# Altium schematic sheet IO Peripherals.SchDoc
size A4; DocumentNumber: 6; Revision: C.1(PCB.SCH); SheetNumber: 4; SheetTotal: 4
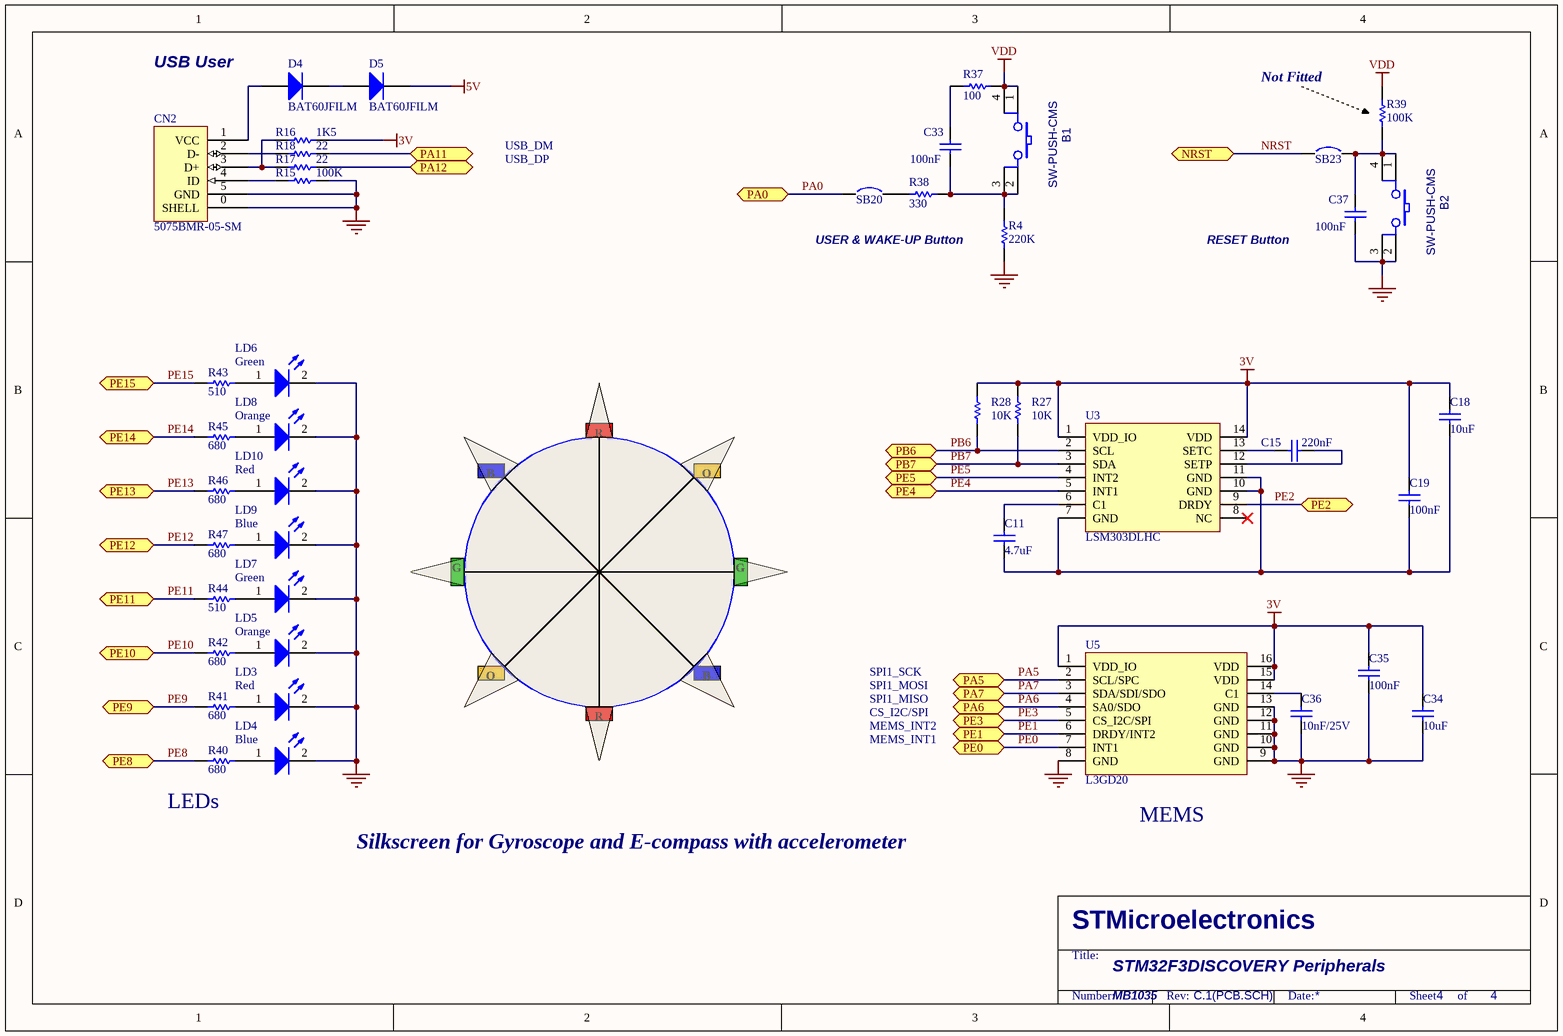
[diagram p0: IO Peripherals.SchDoc]

## Parts
B1  SW-PUSH-CMS  [BP1CMS]
B2  SW-PUSH-CMS  [BP1CMS]
C11  4.7uF  [0603C]
C15  220nF  [0603C]
C18  10uF  [0603C]
C19  100nF  [0603C]
C33  100nF  [0603C]
C34  10uF  [0603C]
C35  100nF  [0603C]
C36  10nF/25V  [0603C]
C37  100nF  [0603C]
CN2  5075BMR-05-SM  [USB-MINI-B-SMD]
D4  BAT60JFILM  [SOD323/A]
D5  BAT60JFILM  [SOD323/A]
LD3  Red  [0603D]
LD4  Blue  [0603D]
LD5  Orange  [0603D]
LD6  Green  [0603D]
LD7  Green  [0603D]
LD8  Orange  [0603D]
LD9  Blue  [0603D]
LD10  Red  [0603D]
R4  220K  [0603R]
R15  100K  [0402R]
R16  1K5  [0402R]
R17  22  [0402R]
R18  22  [0402R]
R27  10K  [0402R]
R28  10K  [0402R]
R37  100  [0402R]
R38  330  [0402R]
R39  100K  [0402R]
R40  680  [0603R]
R41  680  [0603R]
R42  680  [0603R]
R43  510  [0603R]
R44  510  [0603R]
R45  680  [0603R]
R46  680  [0603R]
R47  680  [0603R]
SB20  Circuit Breaker  [JP2_SMD]  (value not drawn)
SB23  Circuit Breaker  [JP2_SMD]  (value not drawn)
U3  LSM303DLHC  [LGA14]
U5  L3GD20  [LGA16]

## Ports
NRST, PA0, PA5, PA6, PA7, PA11, PA12, PB6, PB7, PE0, PE1, PE2, PE3, PE4, PE5, PE8, PE9, PE10, PE11, PE12, PE13, PE14, PE15

## Nets
3V: C18.2 C19.2 C34.2 C35.2 R16.2 R27.1 R28.1 U3.1(VDD_IO) U3.14(VDD) U5.1(VDD_IO) U5.15(VDD) U5.16(VDD)
5V: D5.2(K)
GND: B2.2 B2.3 C34.1 C35.1 C36.1 C37.1 CN2.0(SHELL) CN2.5(GND) LD3.2(K) LD4.2(K) LD5.2(K) LD6.2(K) LD7.2(K) LD8.2(K) LD9.2(K) LD10.2(K) R4.1 R15.2 U5.8(GND) U5.9(GND) U5.10(GND) U5.11(GND) U5.12(GND) U5.13(GND)
VDD: B1.1 B1.4 R37.2 R39.2
NRST: SB23.1 ; port NRST
PA0: SB20.1 ; port PA0
PA5: U5.2(SCL/SPC) ; port PA5
PA6: U5.4(SA0/SDO) ; port PA6
PA7: U5.3(SDA/SDI/SDO) ; port PA7
PA11: R18.2 ; port PA11
PA12: R17.2 ; port PA12
PB6: R28.2 U3.2(SCL) ; port PB6
PB7: R27.2 U3.3(SDA) ; port PB7
PE0: U5.7(INT1) ; port PE0
PE1: U5.6(DRDY/INT2) ; port PE1
PE2: U3.9(DRDY) ; port PE2
PE3: U5.5(CS_I2C/SPI) ; port PE3
PE4: U3.5(INT1) ; port PE4
PE5: U3.4(INT2) ; port PE5
PE8: R40.2 ; port PE8
PE9: R41.2 ; port PE9
PE10: R42.2 ; port PE10
PE11: R44.2 ; port PE11
PE12: R47.2 ; port PE12
PE13: R46.2 ; port PE13
PE14: R45.2 ; port PE14
PE15: R43.2 ; port PE15
NetB1_2: B1.2 B1.3 C33.1 R4.2 R38.2
NetB2_1: B2.1 B2.4 C37.2 R39.1 SB23.2
NetC11_1: C11.1 C18.1 C19.1 U3.7(GND) U3.10(GND) U3.11(GND)
NetC11_2: C11.2 U3.6(C1)
NetC15_1: C15.1 U3.13(SETC)
NetC15_2: C15.2 U3.12(SETP)
NetC33_2: C33.2 R37.1
NetC36_2: C36.2 U5.14(C1)
NetCN2_1: CN2.1(VCC) D4.1(A)
NetCN2_2: CN2.2(D-) R18.1
NetCN2_3: CN2.3(D+) R16.1 R17.1
NetCN2_4: CN2.4(ID) R15.1
NetD4_2: D4.2(K) D5.1(A)
NetLD3_1: LD3.1(A) R41.1
NetLD4_1: LD4.1(A) R40.1
NetLD5_1: LD5.1(A) R42.1
NetLD6_1: LD6.1(A) R43.1
NetLD7_1: LD7.1(A) R44.1
NetLD8_1: LD8.1(A) R45.1
NetLD9_1: LD9.1(A) R47.1
NetLD10_1: LD10.1(A) R46.1
NetR38_1: R38.1 SB20.2

Not connected (* = marked no-connect by the designer): U3 8(NC)*

## Notes on the sheet
- USB User
- Not Fitted
- USB_DM
- USB_DP
- USER & WAKE-UP Button
- RESET Button
- N
- R
- B
- O
- W
- G
- E
- SPI1_MOSI
- SPI1_SCK
- SPI1_MISO
- CS_I2C/SPI
- S
- MEMS_INT1
- MEMS_INT2
- (near R40) LEDs
- Silkscreen for Gyroscope and E-compass with accelerometer
- (near U5) MEMS
- STM32F3DISCOVERY Peripherals
- MB1035
- STMicroelectronics
- Title:
- Number:
- Rev:
- Date:
- Sheet       of

## Library data of the parts
B1 B2 = SW-PUSH-CMS: Non-Open Push-Button 0.1A 24V; Manuf_1: FARNELL; Manuf_Part_1: 535-930; Ref St: 9180120; cap_dec: ---
C11 C15 C18 C34 C36 = CAP: Capacitor; Value: 100nF; Published: 8-Jun-2000; Revision: July-2002: Re-released for DXP Platform.; Publisher: Altium Limited
C19 C33 C35 C37 = CAP: Capacitor; Published: 8-Jun-2000; Revision: July-2002: Re-released for DXP Platform.; Publisher: Altium Limited; Value: 100nF
CN2 = USB-MINI-typeB connector
D4 D5 = BAT60JFILM: Manuf_1: STM; Code - JEDEC: DO-214-AB; Provided: ST; Published: 8-Jun-2000; Revision: July-2002: Re-released for DXP Platform.; Publisher: Altium Limited; Order: BAT60JFILM; Manuf_Part_1: BAT60JFILM
LD3-LD10 = LED2: Typical RED, GREEN, YELLOW, AMBER GaAs LED; Published: 8-Jun-2000; Revision: July-2002: Re-released for DXP Platform.; Publisher: Altium Limited
R4 = res1: Resistor; Value: 10K; Published: 8-Jun-2000; Revision: July-2002: Re-released for DXP Platform.; Publisher: Altium Limited
R15 R16 R27 R28 R38 = res1: Resistor; Published: 8-Jun-2000; Revision: July-2002: Re-released for DXP Platform.; Publisher: Altium Limited
  R15: Value: 100K
  R16: Value: 1K5
  R27 R28: Value: 10K
  R38: Value: 330
R17 R18 = res1: Resistor; Value: 1K5; Published: 8-Jun-2000; Revision: July-2002: Re-released for DXP Platform.; Publisher: Altium Limited
R37 = res1: Resistor; Value: 330; Published: 8-Jun-2000; Revision: July-2002: Re-released for DXP Platform.; Publisher: Altium Limited
R39 = res1: Resistor; Fitted: NO; Published: 8-Jun-2000; Revision: July-2002: Re-released for DXP Platform.; Publisher: Altium Limited; Value: 100K
R40-R47 = Res1: Resistor; Value: 1K; Published: 8-Jun-2000; Revision: July-2002: Re-released for DXP Platform.; Publisher: Altium Limited
SB20 SB23 = Circuit Breaker: Solder: YES; Published: 24-Mar-1999; Revision: July-2002: Re-released for DXP Platform.; Publisher: Altium Limited
U3 = LSM303DLHC: Ultra compact high performance e-compass 3D accelerometer and 3D magnetometer module; Manuf_1: STM; Manuf_Part_1: LSM303DLHCTR; Provided: ST; ref St: xxxxxxxxxx; Distrib: ST; Footprint: LGA14(3*5); Order: LSM303DLHCTR
U5 = L3GD20: MEMS motion sensor three-axis digital output gyroscopeelerometer; Manuf_1: STM; Manuf_Part_1: L3GD20TR; Provided: ST; ref St: xxxxxxxx; Distrib: ST; Footprint: LGA16(4*4); Order: L3GD20TR